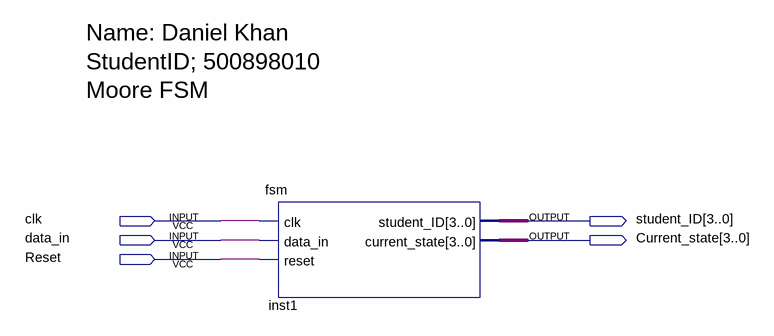
[diagram p0: schematic sheet]
// Quartus schematic fsmSchem.bdf as structural Verilog: 1 symbols, 5 pins
module fsmSchem (
  input  clk,
  input  data_in,
  input  Reset,
  output [3:0] student_ID,
  output [3:0] Current_state
);

  fsm inst1 (.clk(clk), .data_in(data_in), .reset(Reset), .student_ID(student_ID), .current_state(Current_state));

  // Notes on the sheet:
  //   Name: Daniel Khan
  //   StudentID; 500898010
  //   Moore FSM
endmodule
